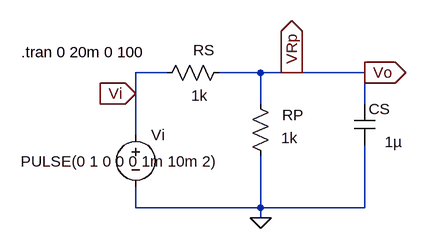
[diagram p0: schematic low_pass.asc]
low_pass.asc, the LTspice schematic file:
Version 4
SHEET 1 880 680
WIRE 144 16 96 16
WIRE 288 16 224 16
WIRE 336 16 288 16
WIRE 448 16 336 16
WIRE 96 48 96 16
WIRE 288 64 288 16
WIRE 448 64 448 16
WIRE 96 112 96 48
WIRE 96 224 96 192
WIRE 288 224 288 144
WIRE 288 224 96 224
WIRE 448 224 448 128
WIRE 448 224 288 224
WIRE 288 240 288 224
FLAG 288 240 0
FLAG 448 16 Vo
IOPIN 448 16 Out
FLAG 96 48 Vi
IOPIN 96 48 In
FLAG 336 16 VRp
IOPIN 336 16 Out
SYMBOL voltage 96 96 R0
WINDOW 3 -177 57 Left 2
WINDOW 123 0 0 Left 0
WINDOW 39 0 0 Left 0
SYMATTR Value PULSE(0 1 0 0 0 1m 10m 2)
SYMATTR InstName Vi
SYMBOL res 272 48 R0
WINDOW 0 49 33 Left 2
WINDOW 3 48 69 Left 2
SYMATTR InstName RP
SYMATTR Value 1k
SYMBOL res 240 0 R90
WINDOW 0 -3 39 VBottom 2
WINDOW 3 36 46 VTop 2
SYMATTR InstName RS
SYMATTR Value 1k
SYMBOL cap 464 128 R180
WINDOW 0 -23 56 Left 2
WINDOW 3 -42 5 Left 2
SYMATTR InstName CS
SYMATTR Value 1µ
TEXT -80 -16 Left 2 !.tran 0 20m 0 100

The netlist it stands for:
* low_pass.asc
Vi Vi 0 PULSE(0 1 0 0 0 1m 10m 2)
RP VRp 0 1k
RS VRp Vi 1k
CS 0 VRp 1µ
.tran 0 20m 0 100
.backanno
.end